# EasyEDA Pro project Modular-Analog-Synthesizer.eprj, board Sequencer-PCB
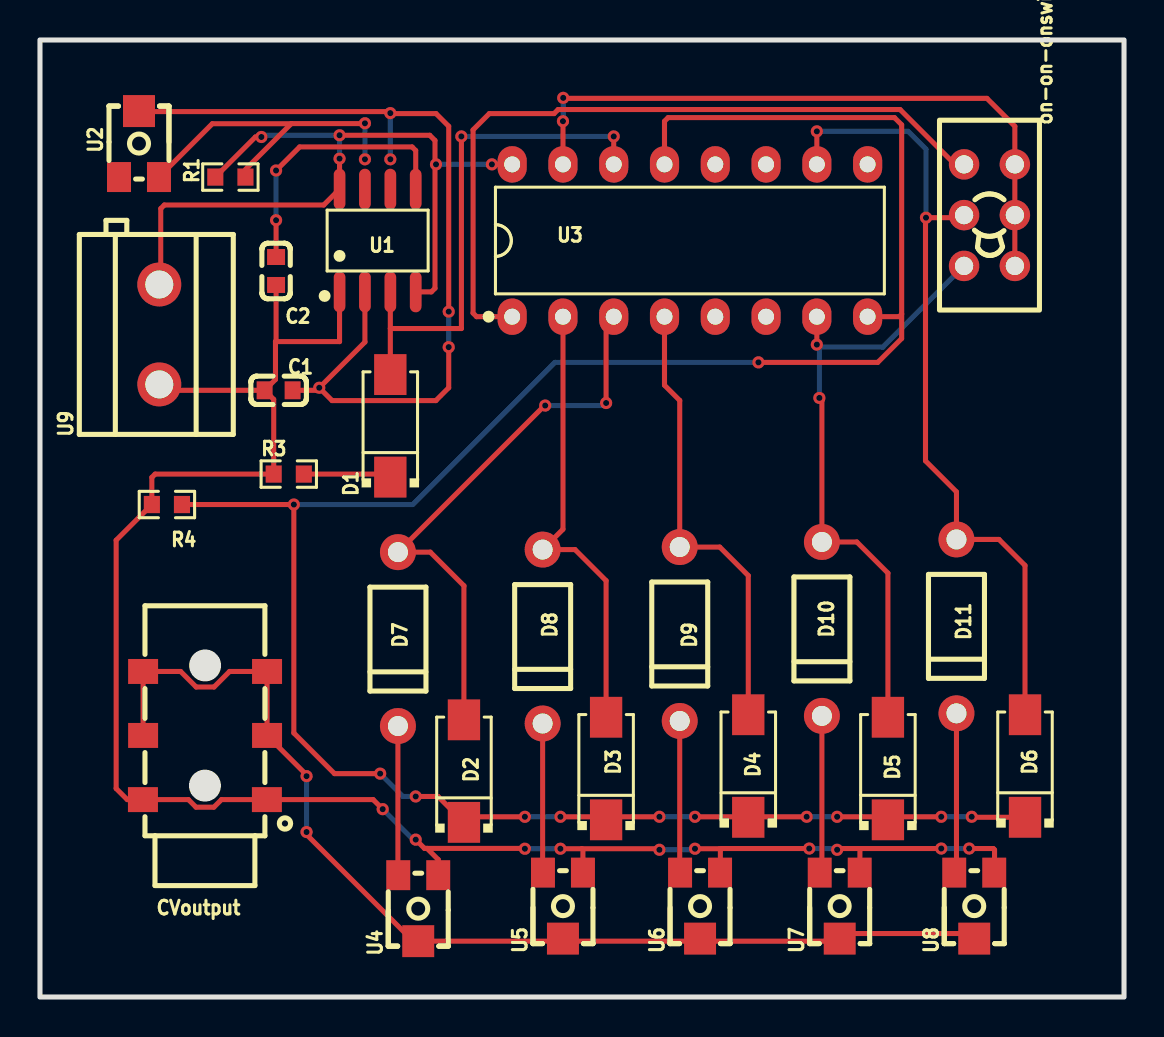
[diagram p5: board, top side]
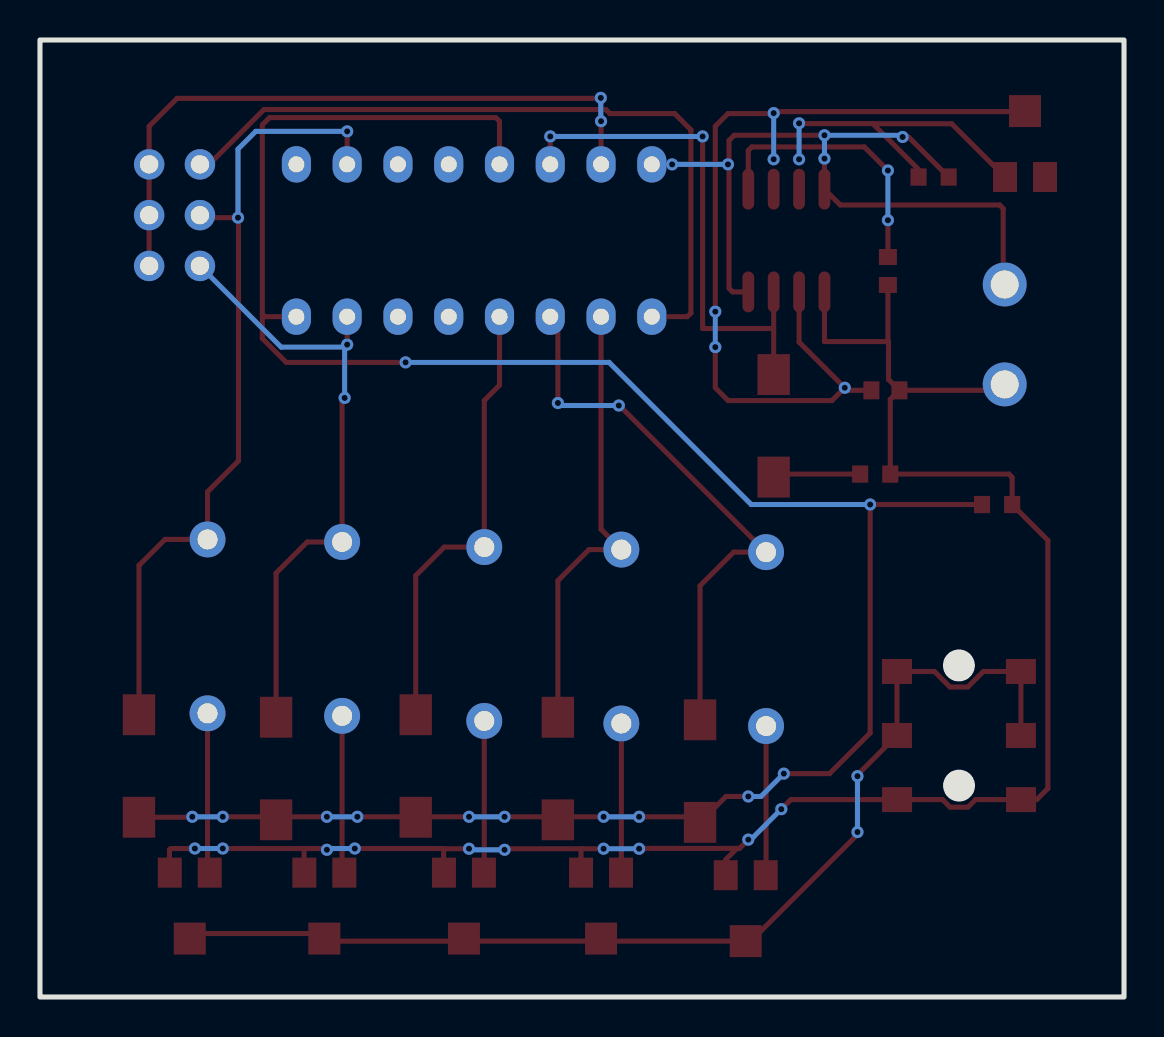
[diagram p6: board, bottom side, seen from below]

Outline 54.23 x 47.88 mm; copper layers: Top Layer, Bottom Layer. Coordinates in mm from the lower left corner of the outline.
Outline path: rectangle 0,47.88 54.23,0
Stack: Top Layer 0.035mm / Dielectric1 1.51mm FR4 er 4.5 / Bottom Layer 0.035mm

## Design rules (mm)
template: JLCPCB Capability(Two Layers Board)
spacing copperThickness1oz (default): track to track 0.102, other pairs 0.152 to 0.3
spacing copperThickness2oz: track to track 0.203, other pairs 0.152 to 0.3
track width copperThickness1oz (default): min 0.127, default 0.254, max 2.54
track width copperThickness2oz: min 0.203, default 0.254, max 2.54
differential pair differentialPair (default): width min 0.127, default 0.254, max 2.54; gap min 0.152, default 0.152
via viaSize (default): diameter min 0.5, default 0.61, max 10; hole min 0.3, default 0.305, max 6.3

## Placement (name value [footprint] x y rotation side)
C1  10µF  [C0603]  11.94 30.35 180 top
C2  10nF  [C0603]  11.81 36.32 270 top
CVoutput  -  [AUDIO-SMD_PJ-313D]  8.25 13.08 180 top
D1  -  [SMA_L4.4-W2.8-LS5.4-RD]  17.53 28.58 90 top
D2  -  [SMA_L4.4-W2.8-LS5.4-RD]  21.21 11.3 90 top
D3  -  [SMA_L4.4-W2.8-LS5.4-RD]  28.32 11.43 90 top
D4  -  [SMA_L4.4-W2.8-LS5.4-RD]  35.43 11.56 90 top
D5  -  [SMA_L4.4-W2.8-LS5.4-RD]  42.42 11.43 90 top
D6  -  [SMA_L4.4-W2.8-LS5.4-RD]  49.28 11.56 90 top
D7  -  [DO-41_BD2.4-L4.7-P8.70-D0.9-RD]  17.91 17.91 90 top
D8  -  [DO-41_BD2.4-L4.7-P8.70-D0.9-RD]  25.15 18.03 90 top
D9  -  [DO-41_BD2.4-L4.7-P8.70-D0.9-RD]  32 18.16 90 top
D10  -  [DO-41_BD2.4-L4.7-P8.70-D0.9-RD]  39.12 18.42 90 top
D11  -  [DO-41_BD2.4-L4.7-P8.70-D0.9-RD]  45.85 18.54 90 top
on-on-onswitch  ATE2D-2M3-10-Z  [SW-TH_ATE2D-2M3-10-Z]  47.5 39.12 90 top
R1  10K  [R0603]  9.53 41.02 0 top
R3  0.22K  [R0603]  12.45 26.16 0 top
R4  470K  [R0603]  6.35 24.64 0 top
U1  NE555  [SOIC-8_L4.9-W3.9-P1.27-LS6.0-BL]  16.89 37.85 0 top
U2  Pot-100k  [RES-ADJ-SMD_VG039NCH]  4.95 42.67 270 top
U3  CD4017BE  [DIP-16_L19.2-W6.6-P2.54-LS7.6-BL]  32.51 37.85 0 top
U4  Pot-100k  [RES-ADJ-SMD_VG039NCH]  18.92 4.45 90 top
U5  Pot-100k  [RES-ADJ-SMD_VG039NCH]  26.16 4.57 90 top
U6  Pot-100k  [RES-ADJ-SMD_VG039NCH]  33.02 4.57 90 top
U7  Pot-100k  [RES-ADJ-SMD_VG039NCH]  40 4.57 90 top
U8  Pot-100k  [RES-ADJ-SMD_VG039NCH]  46.74 4.57 90 top
U9  -  [CONN-TH_P5.00_KF301-5.0-2P]  5.97 33.15 90 top

## Footprints (pads in the part's own frame, mm; a bottom-side part is the same pattern mirrored in y, then rotated)
AUDIO-SMD_PJ-313D
  rect 1.501x1.25 smd: 1(-3.096,3.205) 1(3.104,3.205) 2(-3.104,-3.205) 2(3.096,-3.205) 3(-3.104,-0.005) 3(3.096,-0.005)
C0603
  rect 0.8x0.9 smd: 1(-0.7,0) 2(0.7,0)
CONN-TH_P5.00_KF301-5.0-2P
  round 2.2 hole 1.399: 1(-2.499,0) 2(2.499,0)
DIP-16_L19.2-W6.6-P2.54-LS7.6-BL
  oval 1.46x1.825 hole 0.8: 1(-8.89,-3.81) 2(-6.35,-3.81) 3(-3.81,-3.81) 4(-1.27,-3.81) 5(1.27,-3.81) 6(3.81,-3.81) 7(6.35,-3.81) 8(8.89,-3.81) 9(8.89,3.81) 10(6.35,3.81) 11(3.81,3.81) 12(1.27,3.81) 13(-1.27,3.81) 14(-3.81,3.81) 15(-6.35,3.81) 16(-8.89,3.81)
DO-41_BD2.4-L4.7-P8.70-D0.9-RD
  round 1.8 hole 1: 1(-4.35,0) 2(4.35,0)
R0603
  rect 0.806x0.864 smd: 1(-0.753,0) 2(0.753,0)
RES-ADJ-SMD_VG039NCH
  rect 1.5x1.2 smd: 1(1.65,-1) 3(1.65,1)
  rect 1.6x1.6 smd: 2(-1.65,0)
SMA_L4.4-W2.8-LS5.4-RD
  rect 2.046x1.62 smd: 1(-2.566,0) 2(2.566,0)
SOIC-8_L4.9-W3.9-P1.27-LS6.0-BL
  oval 0.588x2.045 smd: 1(-1.905,-2.57) 2(-0.635,-2.57) 3(0.635,-2.57) 4(1.905,-2.57) 5(1.905,2.57) 6(0.635,2.57) 7(-0.635,2.57) 8(-1.905,2.57)
SW-TH_ATE2D-2M3-10-Z
  round 1.524 hole 0.914: 1(-2.54,1.27) 2(0,1.27) 3(2.54,1.27) 4(-2.54,-1.27) 5(0,-1.27) 6(2.54,-1.27)

## Nets
As in the schematic.

Pads without a net: U2 1; U3 5 6 9 11 12

## Via types
v1: diameter 0.61, hole 0.305, Top Layer to Bottom Layer, 48 vias

## Routing (per net, layer and track width the routed paths; a pad name or vN(x,y) marks a point on that pad's centre or on a via; arc(x,y) is an arc through that point)
GND: length 95.6
  Top Layer w0.254: C1.2 11.69,29.9 R3.1 5.76,26.16 5.6,26 R4.1 3.81,22.85 3.81,10.43 4.37,9.88 CVoutput.1 7.43,9.88 7.81,9.5 8.7,9.5 9.08,9.88 CVoutput.1 16.67,9.88 v1(17.15,9.4) ; C1.2 11.78,30.9 11.78,32.79 ; C1.2 6.64,30.35 6.1,30.9 ; v1(32.77,7.42) 33.98,7.42 34.04,7.37 ; 41.02,7.43 41.02,6.23 U7.1 ; 41.02,7.43 v1(45.09,7.43) ; 41.02,7.43 39.94,7.43 v1(39.88,7.37) ; 11.78,32.79 14.99,32.79 U1.1 ; 11.78,32.79 11.81,32.82 C2.2 ; 19.36,7.44 19.92,6.87 19.92,6.09 ; 19.36,7.44 19.23,7.44 v1(18.8,7.87) ; 19.36,7.44 24.24,7.44 v1(24.26,7.42) ; 34.02,6.09 34.04,6.11 34.04,7.37 ; 34.04,7.37 34.1,7.43 v1(38.48,7.43) ; v1(46.48,7.43) 47.69,7.43 47.75,7.37 47.75,6.24 U8.1 ; 27.11,7.42 27.16,7.37 27.16,6.09 ; 27.11,7.42 30.94,7.42 v1(30.99,7.37) ; 27.11,7.42 v1(26.03,7.42)
  Bottom Layer w0.254: v1(17.15,9.4) 18.67,7.87 v1(18.8,7.87) ; v1(30.99,7.37) 32.71,7.37 v1(32.77,7.42) ; v1(46.48,7.43) v1(45.09,7.43) ; v1(26.03,7.42) v1(24.26,7.42) ; v1(39.88,7.37) 39.81,7.43 v1(38.48,7.43)
VCC: length 39.8
  Top Layer w0.254: R1.1 10.78,43.03 v1(11.08,43.03) ; v1(14.99,43.11) 19.5,43.11 19.76,42.85 19.76,35.46 19.58,35.28 U1.4 ; 6.1,35.9 6.04,35.95 6.04,39.44 6.22,39.62 14.19,39.62 U1.8 v1(14.99,41.94) ; v1(22.61,41.66) U3.16
  Bottom Layer w0.254: v1(22.61,41.66) v1(19.81,41.66) ; v1(11.08,43.03) 11.16,43.11 v1(14.99,43.11) v1(14.99,41.94)
$1N1040: length 4.4
  Top Layer w0.254: D1.1 17.37,26.16 R3.2
$1N1543: length 26.3
  Top Layer w0.254: 17.53,33.44 21.08,33.44 21.08,43.05 ; 17.53,33.44 U1.3 ; 17.53,33.44 D1.2 ; v1(28.7,43.05) U3.14
  Bottom Layer w0.254: v1(21.08,43.05) v1(28.7,43.05)
$1N2347: length 41.1
  Top Layer w0.254: U3.10 v1(38.86,43.31) ; D6.2 49.28,21.59 47.97,22.89 D11.2 45.85,25.27 44.3,26.82 44.3,38.96 v1(44.32,38.99) 46.1,38.99 on-on-onswitch.2
  Bottom Layer w0.254: v1(44.32,38.99) 44.32,42.42 43.43,43.31 v1(38.86,43.31)
$1N2923: length 45.4
  Top Layer w0.254: v1(20.45,32.51) 20.45,30.48 19.81,29.84 14.61,29.84 v1(13.97,30.48) ; v1(20.45,34.29) 20.45,43.56 19.81,44.2 17.55,44.2 v1(17.53,44.22) 17.53,44.27 17.5,44.3 4.98,44.3 U2.2 ; v1(13.97,30.48) 13.84,30.35 C1.1 ; v1(13.97,30.48) 16.26,32.77 U1.2
  Bottom Layer w0.254: v1(17.53,44.22) v1(17.53,41.91) ; v1(20.45,32.51) v1(20.45,34.29)
$1N2927: length 16.5
  Top Layer w0.254: U2.3 8.62,43.69 12.56,43.69 ; 12.56,43.69 10.28,41.4 ; 12.56,43.69 12.57,43.7 16.24,43.7 v1(16.26,43.71)
  Bottom Layer w0.254: v1(16.26,43.71) v1(16.26,41.91)
$1N2930: length 13.8
  Top Layer w0.254: U1.5 18.8,42.35 18.62,42.53 12.99,42.53 v1(11.81,41.35) ; C2.1 v1(11.81,38.86)
  Bottom Layer w0.254: v1(11.81,41.35) v1(11.81,38.86)
$1N4168: length 37.3
  Top Layer w0.254: U3.1 21.84,34.04 21.66,34.22 21.66,43.38 22.48,44.2 25.72,44.2 25.92,44.4 43.03,44.4 45.77,41.66 on-on-onswitch.3
$1N4634: length 33.5
  Top Layer w0.254: v1(26.16,43.81) U3.15 ; v1(26.17,44.98) 26.2,44.96 47.37,44.96 48.77,43.56 on-on-onswitch.6 on-on-onswitch.5 on-on-onswitch.4
  Bottom Layer w0.254: v1(26.16,43.81) 26.17,43.83 v1(26.17,44.98)
$1N5515: length 54.8
  Top Layer w0.254: 33.4,2.8 U4.2 18.67,2.8 13.34,8.13 v1(13.34,8.25) ; CVoutput.3 CVoutput.2 7.04,16.29 7.81,15.51 8.71,15.51 9.48,16.29 CVoutput.2 CVoutput.3 13.34,11.11 v1(13.34,11.05) ; 33.4,2.79 39.75,2.79 40.13,3.18 46.74,3.18
  Bottom Layer w0.254: v1(13.34,8.25) v1(13.34,11.05)
$1N6043: length 7.5
  Top Layer w0.254: 17.92,6.09 17.91,6.11 D7.1
$1N6049: length 28.9
  Top Layer w0.254: U3.3 28.32,33.66 v1(28.32,29.72) ; D2.2 21.21,20.57 19.53,22.26 17.91,22.26 25.24,29.59 v1(25.27,29.59) ; 17.78,22.64 17.65,22.51
  Bottom Layer w0.254: v1(25.27,29.59) 28.19,29.59 v1(28.32,29.72)
$1N6089: length 7.6
  Top Layer w0.254: 25.16,6.09 25.15,6.11 D8.1
$1N6096: length 22.7
  Top Layer w0.254: D3.2 28.32,20.83 26.76,22.38 D8.2 26.16,23.4 U3.2
$1N6135: length 7.3
  Top Layer w0.254: D9.1 32,6.49 32.02,6.48
$1N6142: length 22.8
  Top Layer w0.254: D4.2 35.43,21.08 34,22.51 D9.2 32,29.84 31.24,30.61 U3.4
$1N6181: length 7.9
  Top Layer w0.254: D10.1 39.12,6.33 U7.3
$1N6228: length 8
  Top Layer w0.254: U8.3 45.85,6.33 D11.1
$1N6339: length 31.5
  Top Layer w0.254: v1(38.99,29.97) 39.12,29.84 D10.2 40.86,22.77 42.42,21.21 D5.2 ; v1(38.86,32.64) U3.7
  Bottom Layer w0.254: on-on-onswitch.1 42.16,32.51 38.99,32.51 ; 38.99,32.51 v1(38.86,32.64) ; 38.99,32.51 v1(38.99,29.97)
$1N6469: length 116.4
  Top Layer w0.254: 43.11,34.16 43.11,43.64 42.75,43.99 31.42,43.99 31.24,43.81 U3.13 ; 43.11,34.16 43.11,32.95 41.91,31.75 v1(35.94,31.75) ; 43.11,34.16 42.98,34.04 U3.8 ; v1(26.03,9.02) 28.17,9.02 D3.1 28.47,9.02 v1(30.99,9.02) ; v1(17.02,11.18) 14.73,11.18 12.7,13.21 v1(12.7,24.64) R4.2 ; v1(32.77,9.02) 35.41,9.02 D4.1 35.46,9.02 v1(38.35,9.02) ; v1(24.26,9.02) 21.49,9.02 D2.1 19.91,10.03 v1(18.8,10.03) ; v1(46.61,9.02) 46.63,8.99 D6.1 ; v1(45.09,9.02) 42.54,9.02 42.42,8.89 ; v1(39.88,9.02) 42.27,9.02 D5.1
  Bottom Layer w0.254: v1(12.7,24.64) 18.65,24.64 25.76,31.75 v1(35.94,31.75) ; v1(26.03,9.02) v1(24.26,9.02) ; v1(17.02,11.18) 18.16,10.03 v1(18.8,10.03) ; v1(32.77,9.02) v1(30.99,9.02) ; v1(46.61,9.02) v1(45.09,9.02) ; v1(39.88,9.02) v1(38.35,9.02)
